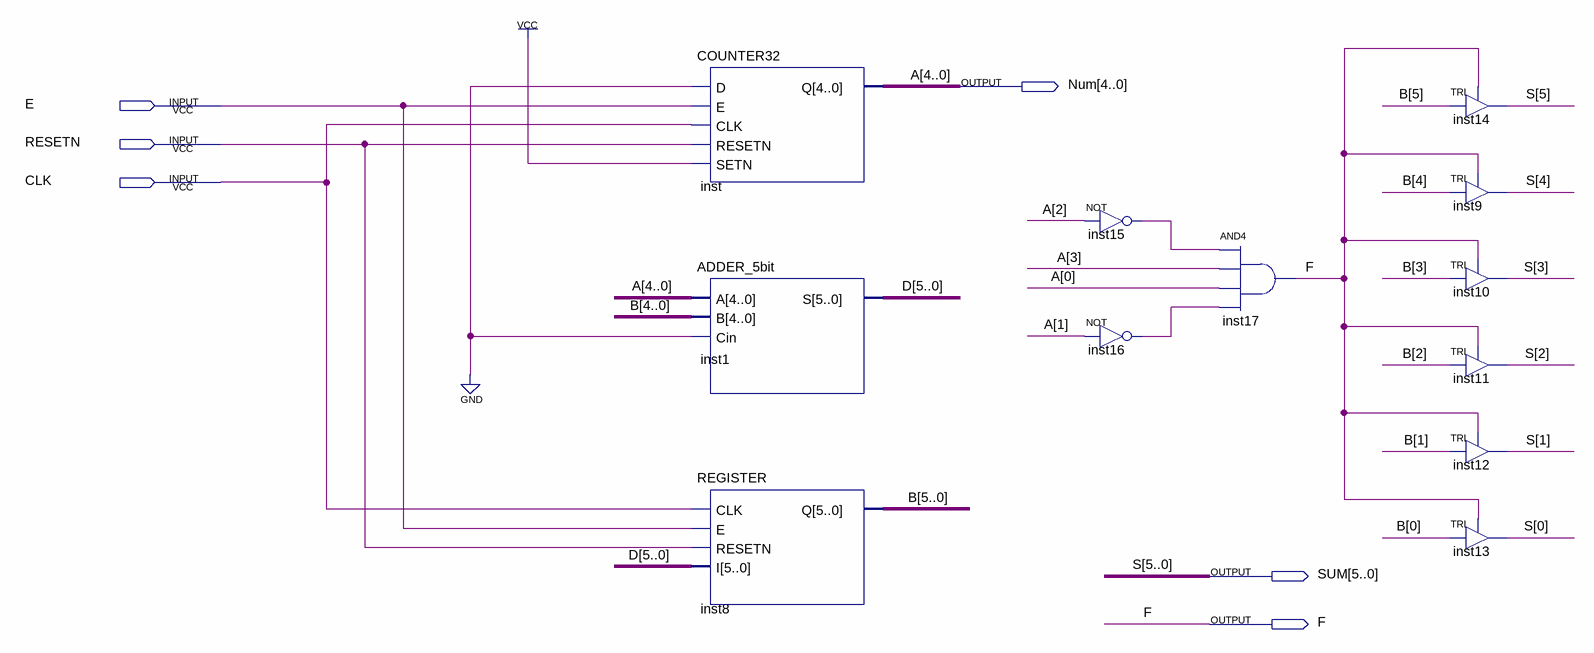
[diagram p0: schematic sheet]
// Quartus schematic SUM_1_to_8.bdf as structural Verilog: 12 symbols, 6 pins
module SUM_1_to_8 (
  input  E,
  input  RESETN,
  input  CLK,
  output [4:0] Num,
  output [5:0] SUM,
  output F
);

  wire inst15_out, inst16_out;
  wire [5:0] B, D;

  COUNTER32 inst (.D(1'b0), .E(E), .CLK(CLK), .RESETN(RESETN), .SETN(1'b1), .Q(Num));
  ADDER_5bit inst1 (.A(Num), .B(B[4:0]), .Cin(1'b0), .S(D));
  REGISTER inst8 (.CLK(CLK), .E(E), .RESETN(RESETN), .I(D), .Q(B));
  not inst15 (inst15_out, Num[2]);
  not inst16 (inst16_out, Num[1]);
  and inst17 (F, inst15_out, Num[3], Num[0], inst16_out);
  TRI inst14 (.IN(B[5]), .OE(F), .OUT(SUM[5]));
  TRI inst9 (.IN(B[4]), .OE(F), .OUT(SUM[4]));
  TRI inst10 (.IN(B[3]), .OE(F), .OUT(SUM[3]));
  TRI inst11 (.IN(B[2]), .OE(F), .OUT(SUM[2]));
  TRI inst12 (.IN(B[1]), .OE(F), .OUT(SUM[1]));
  TRI inst13 (.IN(B[0]), .OE(F), .OUT(SUM[0]));

  // Other names for the same wires on the sheet: A[4:0] = Num; S[5:0] = SUM
endmodule
